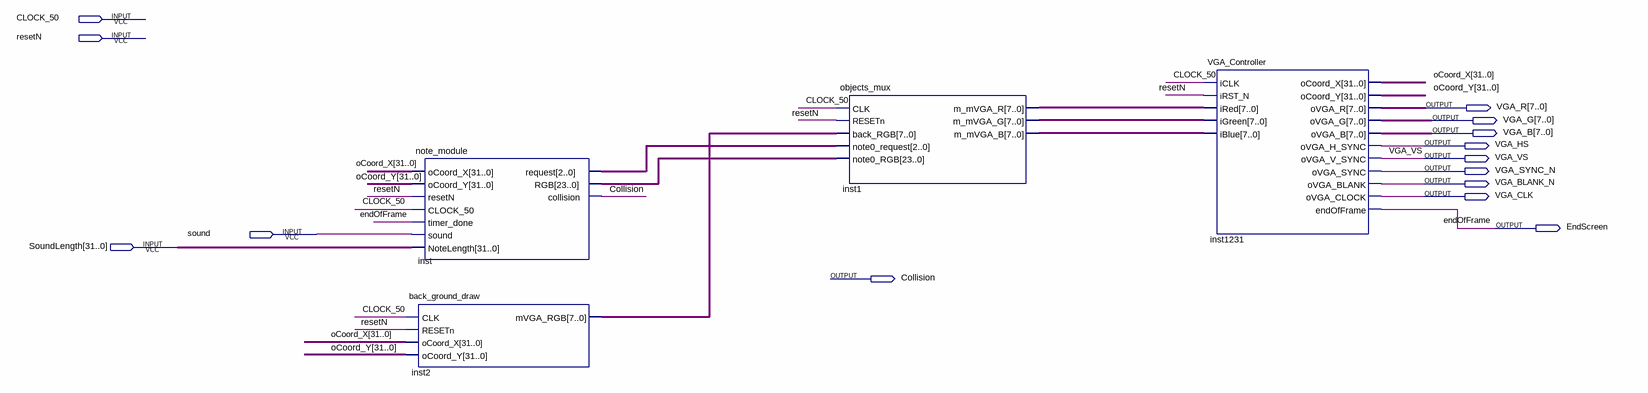
[diagram p0: schematic sheet]
// Quartus schematic graphics_module_diag.bdf as structural Verilog: 4 symbols, 14 pins
module graphics_module_diag (
  input  CLOCK_50,
  input  resetN,
  input  sound,
  input  [31:0] SoundLength,
  output [7:0] VGA_R,
  output [7:0] VGA_G,
  output [7:0] VGA_B,
  output VGA_HS,
  output VGA_VS,
  output VGA_SYNC_N,
  output VGA_BLANK_N,
  output VGA_CLK,
  output EndScreen,
  output Collision
);

  wire [2:0] inst_request;
  wire [7:0] inst1_m_mvga_b, inst1_m_mvga_g, inst1_m_mvga_r, inst2_mvga_rgb;
  wire [23:0] inst_rgb;
  wire [31:0] oCoord_X, oCoord_Y;

  note_module inst (
    .oCoord_X(oCoord_X), .oCoord_Y(oCoord_Y), .resetN(resetN), .CLOCK_50(CLOCK_50), .timer_done(EndScreen),
    .sound(sound), .NoteLength(SoundLength), .request(inst_request), .RGB(inst_rgb), .collision(Collision));
  back_ground_draw inst2 (
    .CLK(CLOCK_50), .RESETn(resetN), .oCoord_X(oCoord_X), .oCoord_Y(oCoord_Y), .mVGA_RGB(inst2_mvga_rgb));
  objects_mux inst1 (
    .CLK(CLOCK_50), .RESETn(resetN), .back_RGB(inst2_mvga_rgb), .note0_request(inst_request),
    .note0_RGB(inst_rgb), .m_mVGA_R(inst1_m_mvga_r), .m_mVGA_G(inst1_m_mvga_g), .m_mVGA_B(inst1_m_mvga_b));
  VGA_Controller inst1231 (
    .iCLK(CLOCK_50), .iRST_N(resetN), .iRed(inst1_m_mvga_r), .iGreen(inst1_m_mvga_g), .iBlue(inst1_m_mvga_b),
    .oCoord_X(oCoord_X), .oCoord_Y(oCoord_Y), .oVGA_R(VGA_R), .oVGA_G(VGA_G), .oVGA_B(VGA_B),
    .oVGA_H_SYNC(VGA_HS), .oVGA_V_SYNC(VGA_VS), .oVGA_SYNC(VGA_SYNC_N), .oVGA_BLANK(VGA_BLANK_N),
    .oVGA_CLOCK(VGA_CLK), .endOfFrame(EndScreen));

  // Other names for the same wires on the sheet: endOfFrame = EndScreen
endmodule
